# EAGLE design Jolt (EAGLE 8.3.1)
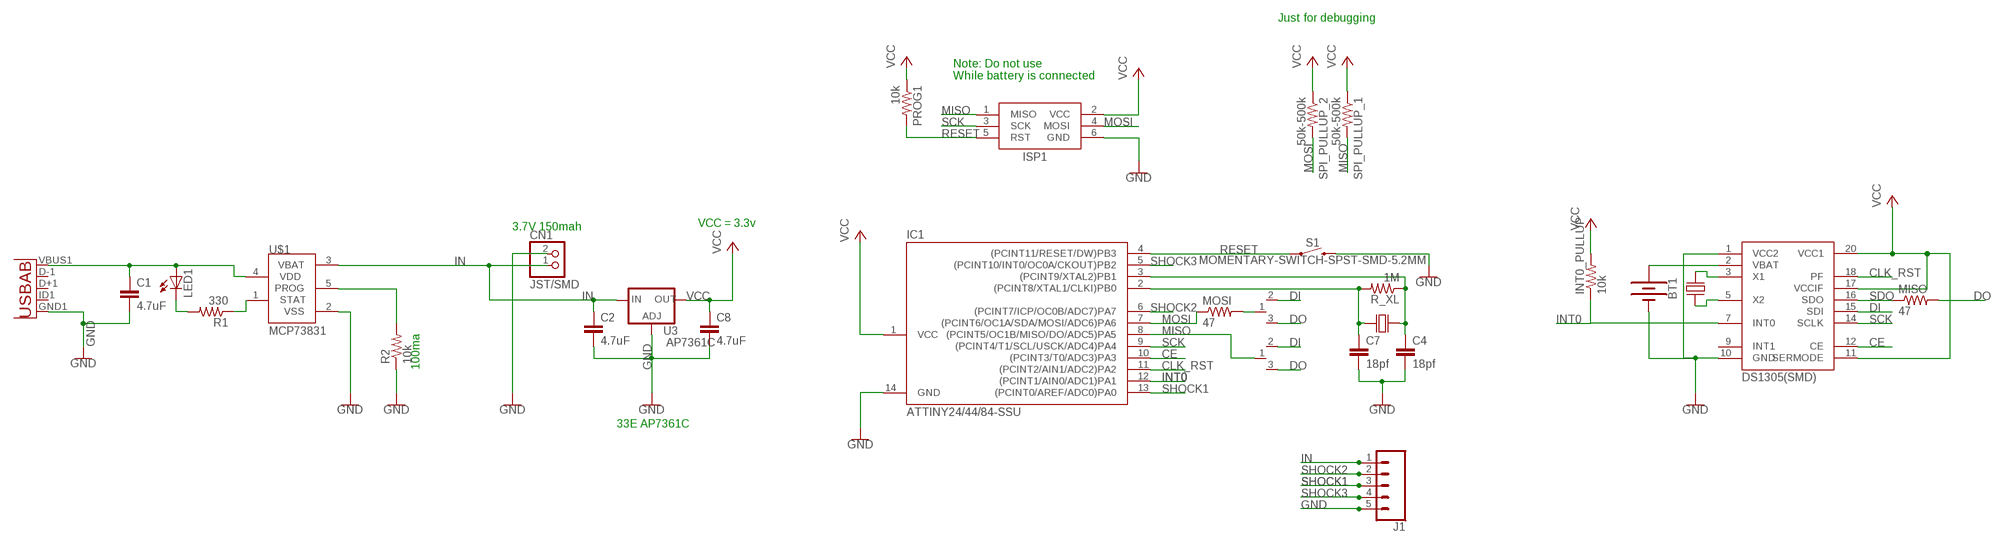
[diagram p0: schematic, sheet 1]

## Parts
BT1  BATTERY-20MM_SMD_4LEGS_OVERPASTE  [BATTCON_20MM_4LEGS_OVERPASTE]
C1  4.7uF  C-EUC0603K  [C0603K]
C2  4.7uF  C-EUC0603K  [C0603K]
C4  18pf  10NF-0603-50V-10%  [0603]
C7  18pf  10NF-0603-50V-10%  [0603]
C8  4.7uF  C-EUC0603K  [C0603K]
CN1  JST/SMD  JST_2PIN-SMT  [JST-PH-2-SMT]
IC1  ATTINY24/44/84-SSU  [SOIC14]
INT0_PULLUP  10k  R-US_R0603  [R0603]
ISP1  AVRISP-6  [AVRISP]
J1  CONN_05  [1X05]
LED1  LEDCHIPLED_0603  [CHIPLED_0603]
MISO  47  R-US_R0603  [R0603]
MOSI  47  R-US_R0603  [R0603]
PROG1  10k  R-US_R0603  [R0603]
R1  330  R-US_R0603  [R0603]
R2  10k  R-US_R0603  [R0603]
R_XL  1M  R-US_R0603  [R0603]
S1  MOMENTARY-SWITCH-SPST-SMD-5.2MM  [TACTILE_SWITCH_SMD_5.2MM]
SPI_PULLUP_1  50k-500k  R-US_R0603  [R0603]
SPI_PULLUP_2  50k-500k  R-US_R0603  [R0603]
U1  USB""  [USB-MICRO-SMD]
U3  AP7361C  V_REG_317SMD  [SOT223]
U$1  MCP73831  [SOT23-5L]
U$2  DS1305(SMD)  [TSSOP]
U$3  CRYSTAL_SOJ  [SOJ-4-5.5MM]
U$4  0603_SMD_JUMPER  [0603_SMD_JUMPER]
U$5  0603_SMD_JUMPER  [0603_SMD_JUMPER]
U$6  CRYSTAL-SMD-HC-49US  [CRYSTAL_SMD_HC-49/US]

## Nets
CE: IC1.10((PCINT3/T0/ADC3)PA3) U$2.12(CE)
CLK_RST: IC1.11((PCINT2/AIN1/ADC2)PA2) U$2.18(PF)
DI: U$2.15(SDI) U$4.2(O2) U$5.2(O2)
DO: MISO.2 U$4.3(O1) U$5.3(O1)
GND: BT1.2(-) C1.2 C2.2 C4.2 C7.2 C8.2 CN1.2 IC1.14(GND) ISP1.6(GND) J1.5 R2.1 S1.3 U1.GND1(GND) U3.1(ADJ) U$1.2(VSS) U$2.1(VCC2) U$2.10(GND)
IN: C2.1 CN1.1 J1.1 U3.3(IN) U$1.3(VBAT)
INT0: IC1.12((PCINT1/AIN0/ADC1)PA1) INT0_PULLUP.1 U$2.7(INT0)
MISO: IC1.8((PCINT5/OC1B/MISO/DO/ADC5)PA5) ISP1.1(MISO) SPI_PULLUP_1.2 U$5.1(IN)
MOSI: IC1.7((PCINT6/OC1A/SDA/MOSI/ADC6)PA6) ISP1.4(MOSI) MOSI.1 SPI_PULLUP_2.2
N$1: C1.1 LED1.A U1.VBUS1(VBUS) U$1.4(VDD)
N$2: MOSI.2 U$4.1(IN)
N$3: R1.1 U$1.1(STAT)
N$4: LED1.C R1.2
N$5: R2.2 U$1.5(PROG)
N$15: C7.1 IC1.2((PCINT8/XTAL1/CLKI)PB0) R_XL.2 U$6.P$2
N$16: C4.1 IC1.3((PCINT9/XTAL2)PB1) R_XL.1 U$6.P$1
N$20: BT1.1(+) U$2.2(VBAT)
N$22: U$2.5(X2) U$3.P$3
N$23: U$2.3(X1) U$3.P$1
RESET: IC1.4((PCINT11/RESET/DW)PB3) ISP1.5(RST) PROG1.2 S1.1
SCK: IC1.9((PCINT4/T1/SCL/USCK/ADC4)PA4) ISP1.3(SCK) U$2.14(SCLK)
SDO: MISO.1 U$2.16(SDO)
SHOCK1: IC1.13((PCINT0/AREF/ADC0)PA0) J1.3
SHOCK2: IC1.6((PCINT7/ICP/OC0B/ADC7)PA7) J1.2
SHOCK3: IC1.5((PCINT10/INT0/OC0A/CKOUT)PB2) J1.4
VCC: C8.1 IC1.1(VCC) INT0_PULLUP.2 ISP1.2(VCC) PROG1.1 SPI_PULLUP_1.1 SPI_PULLUP_2.1 U3.2(OUT) U$2.11(SERMODE) U$2.17(VCCIF) U$2.20(VCC1)
Unconnected: U1.D+1(D+) U1.D-1(D-) U1.ID1(USBID) U$2.9(INT1)

## Notes on the sheet
- Just for debugging
- Note: Do not use
  While battery is connected
- VCC = 3.3v
- 3.7V 150mah
- 100ma
- 33E AP7361C

## Library data of the parts
BT1 = SparkFun-Batteries:BATTERY: Battery - Single Cell A variety of battery chemistries, sizes, and footprints. Device List: 20MM_PTH - Coin Cell Battery Holder - 20mm (PTH) <https://www.sparkfun.com/products/783> 6.8MM_PTH - Coin Cell Battery Holder - 6.8MM(SMD) <https://www.digikey.com/product-detail/en/seiko-instruments/MS621FE-FL11E/728-1057-ND/1889208?WT.srch=1&gclid=CNOQ5a6LzdQCFZS2wAodXCkE0g> 12MM_SMD - Coin Cell Battery Holder - 12mm (SMD) <https://www.sparkfun.com/products/10592> 12MM_PTH - Coin Cell Battery Holder - 12mm (PTH) <https://www.sparkfun.com/products/7948> 20MM_SMD - 20mm Coin Cell Battery Holder (SMD) (2 legs) Used on the Big Time Watch Kit <https://www.sparkfun.com/products/11734> 20MM_SMD_4LEGS - Coin Cell Battery Holder - 20mm (SMD) <https://www.sparkfun.com/products/11892> 20MM_SMD_4LEGS_OVERPASTE - Coin Cell Battery Holder - 20mm (SMD) <https://www.sparkfun.com/products/11892> (Over-paste on the legs) 24.5MM_PTH - Coin Cell Battery Holder - 24.5mm (PTH) <https://www.sparkfun.com/products/8863> 9V - 9V Battery Holder - PC Mount Used on the SparkFun SparkPunk Sound Kit <https://www.sparkfun.com/products/11177> and SparkFun SparkPunk Sequencer Kit <https://www.sparkfun.com/products/12707> 18650 - Battery Holder - 18650 (PTH) <https://www.sparkfun.com/products/13113> AA - Battery Holder - 1xAA (PTH) <https://www.sparkfun.com/products/7949> AAA - Battery Holder - 1xAAA (PTH) <https://www.sparkfun.com/products/12718> AA_KIT - Battery Holder - 1xAA (PTH) <https://www.sparkfun.com/products/7949> Special kit package - pads only have exposed copper on one side of the board. AAA_KIT - Battery Holder - 1xAAA (PTH) <https://www.sparkfun.com/products/12718> Special kit package - pads only have exposed copper on one side of the board.; PROD_ID: PRT-11892; SF_SKU: BATT-10373
C1 C2 C8 = resistor:C-EU: CAPACITOR, European symbol
C4 C7 = SparkFun-Capacitors:10NF: 0.01uF/10nF/10,000pF ceramic capacitors A capacitor is a passive two-terminal electrical component used to store electrical energy temporarily in an electric field. CAP-09321; PROD_ID: CAP-00867; VALUE: 10nF
CN1 = adafruit:JST_2PIN: JST 2-Pin Connectors of various flavors SMT-RA (S2B-PH-SM4) 4UConnector #17311 SMT (B2B-PH-SM4) THM-RA (S2B-PH) THM (B2B-PH)
IC1 = attiny24_44_84:ATTINY24/44/84
INT0_PULLUP MISO MOSI PROG1 R1 R2 R_XL SPI_PULLUP_1 SPI_PULLUP_2 = adafruit:R-US_: RESISTOR, American symbol
ISP1 = adafruit:AVRISP: AVR ISP HEADER Standard 6 pin header for AVR programming
J1 = SparkFun-Connectors:CONN_05: Multi connection point. Often used as Generic Header-pin footprint for 0.1 inch spaced/style header connections On any of the 0.1 inch spaced packages, you can populate with these: Break Away Headers - Straight <https://www.sparkfun.com/products/116> (PRT-00116) Break Away Male Headers - Right Angle <https://www.sparkfun.com/products/553> (PRT-00553) Female Headers <https://www.sparkfun.com/products/115> (PRT-00115) Break Away Headers - Machine Pin <https://www.sparkfun.com/products/117> (PRT-00117) Break Away Female Headers - Swiss Machine Pin <https://www.sparkfun.com/products/743> (PRT-00743) For SCREWTERMINALS and SPRING TERMINALS visit here: Screw Terimnals on SparkFun.com <https://www.sparkfun.com/search/results?term=Screw+Terminals> (5mm/3.5mm/2.54mm spacing) This device is also useful as a general connection point to wire up your design to another part of your project. Our various solder wires solder well into these plated through hole pads. Hook-Up Wire - Assortment (Stranded, 22 AWG) <https://www.sparkfun.com/products/11375> (PRT-11375) Hook-Up Wire - Assortment (Solid Core, 22 AWG) <https://www.sparkfun.com/products/11367> (PRT-11367) View the entire wire category on our website here <https://www.sparkfun.com/categories/141> Special notes: Molex polarized connector foot print use with SKU : PRT-08231 with associated crimp pins and housings. 1MM SMD Version SKU: PRT-10208
LED1 = adafruit:LED: LED OSRAM: - CHIPLED LG R971, LG N971, LY N971, LG Q971, LY Q971, LO R971, LY R971 LH N974, LH R974 LS Q976, LO Q976, LY Q976 LO Q996 - Hyper CHIPLED LW Q18S LB Q993, LB Q99A, LB R99A - SideLED LS A670, LO A670, LY A670, LG A670, LP A670 LB A673, LV A673, LT A673, LW A673 LH A674 LY A675 LS A676, LA A676, LO A676, LY A676, LW A676 LS A679, LY A679, LG A679 - Hyper Micro SIDELED® LS Y876, LA Y876, LO Y876, LY Y876 LT Y87S - SmartLED LW L88C, LW L88S LB L89C, LB L89S, LG L890 LS L89K, LO L89K, LY L89K LS L896, LA L896, LO L896, LY L896 - TOPLED LS T670, LO T670, LY T670, LG T670, LP T670 LSG T670, LSP T670, LSY T670, LOP T670, LYG T670 LG T671, LOG T671, LSG T671 LB T673, LV T673, LT T673, LW T673 LH T674 LS T676, LA T676, LO T676, LY T676, LB T676, LH T676, LSB T676, LW T676 LB T67C, LV T67C, LT T67C, LS T67K, LO T67K, LY T67K, LW E67C LS E67B, LA E67B, LO E67B, LY E67B, LB E67C, LV E67C, LT E67C LW T67C LS T679, LY T679, LG T679 LS T770, LO T770, LY T770, LG T770, LP T770 LB T773, LV T773, LT T773, LW T773 LH T774 LS E675, LA E675, LY E675, LS T675 LS T776, LA T776, LO T776, LY T776, LB T776 LHGB T686 LT T68C, LB T68C - Hyper Mini TOPLED® LB M676 - Mini TOPLED Santana® LG M470 LS M47K, LO M47K, LY M47K Source: http://www.osram.convergy.de/
S1 = SparkFun-Switches:MOMENTARY-SWITCH-SPST: Momentary Switch (Pushbutton) - SPST Normally-open (NO) SPST momentary switches (buttons, pushbuttons). Variants PTH-12MM - 12mm square, through-hole Momentary Pushbutton Switch - 12mm Square <https://www.sparkfun.com/products/9190> (COM-09190) PTH-6.0MM, PTH-6.0MM-KIT - 6.0mm square, through-hole Mini Pushbutton Switch <https://www.sparkfun.com/products/97> (COM-00097) KIT package intended for soldering kit's - only one side of pads' copper is exposed. PTH-RIGHT-ANGLE-KIT - Right-angle, through-hole Right Angle Tactile Button <https://www.sparkfun.com/products/10791> - Used on SparkFun BigTime Watch Kit <https://www.sparkfun.com/products/11734> SMD-12MM - 12mm square, surface-mount Tactile Button - SMD (12mm) <https://www.sparkfun.com/products/12993> (COM-12993) Used on SparkFun PicoBoard <https://www.sparkfun.com/products/11888> SMD-4.5MM - 4.5mm Square Trackball Switch Used on SparkFun Blackberry Trackballer Breakout <https://www.sparkfun.com/products/13169> SMD-4.6MMX2.8MM - 4.60mm x 2.80mm, surface mount Used on SparkFun SAMD21 Mini Breakout <https://www.sparkfun.com/products/13664> SMD-5.2MM, SMD-5.2-REDUNDANT - 5.2mm square, surface-mount Mini Pushbutton Switch - SMD <https://www.sparkfun.com/products/8720> (COM-08720) Used on Arduino Pro Mini <https://www.sparkfun.com/products/11114> REDUNDANT package connects both switch circuits together SMD-6.0X3.5MM - 6.0 x 3.5mm, surface mount Momentary Reset Switch SMD <https://www.sparkfun.com/products/8229> (COM-08229) SMD-6.2MM-TALL - 6.2mm square, surface mount Tactile Button - SMD (6mm) <https://www.sparkfun.com/products/12992> Used on SparkFun Digital Sandbox <https://www.sparkfun.com/products/12651> SMD-RIGHT-ANGLE - Right-angle, surface mount Used on SparkFun Block for Intel® Edison - Arduino <https://www.sparkfun.com/products/13036>; PROD_ID: SWCH-08247; SF_SKU: COM-08720
U1 = MicroUSB:USB: This is a USB AB connector that is compatible with USB OTG. i.e. this connector can serve as a host or device
U3 = SparkFun-IC-Power:V_REG_317: Voltage Regulator Standard LM317 adjustable voltage regulator. AOI (Adjust Output Input). Google 'LM317 Calculator' for easy to use app to get the two resistor values needed. 240/720 for 5V output. 240/390 for 3.3V output. Spark Fun Electronics SKU : COM-00527
U$1 = mcp73831:MCP73831: Miniature Single-Cell, Fully Integrated Li-Ion, Li-Polymer Charge Management Controllers
U$2 = Nick's Personal Part:DS1305(SMD)
U$3 = Nick's Personal Part:CRYSTAL_SOJ
U$4 U$5 = Nick's Personal Part:0603_SMD_JUMPER
U$6 = Nick's Personal Part:CRYSTAL-SMD-HC-49US

## Module REGULATOR
Ports: 

### Library data of the parts

## Board
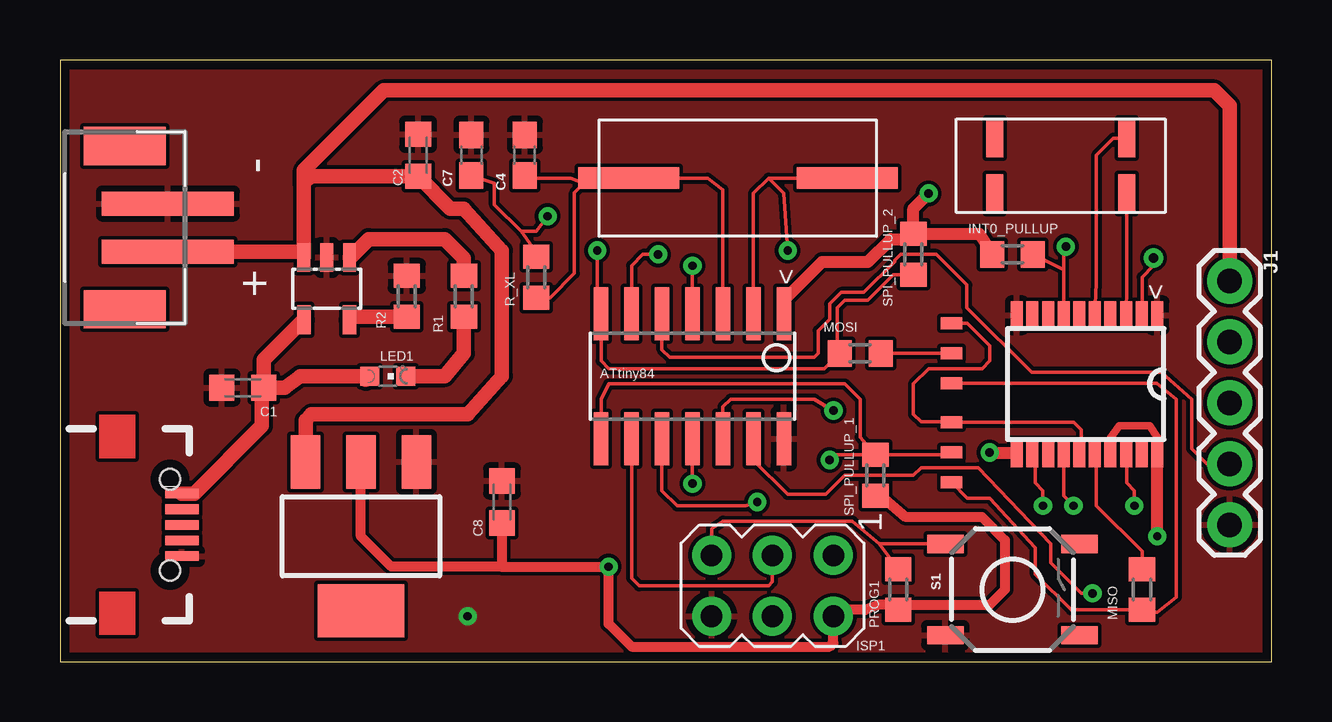
[diagram p1: board, top side]
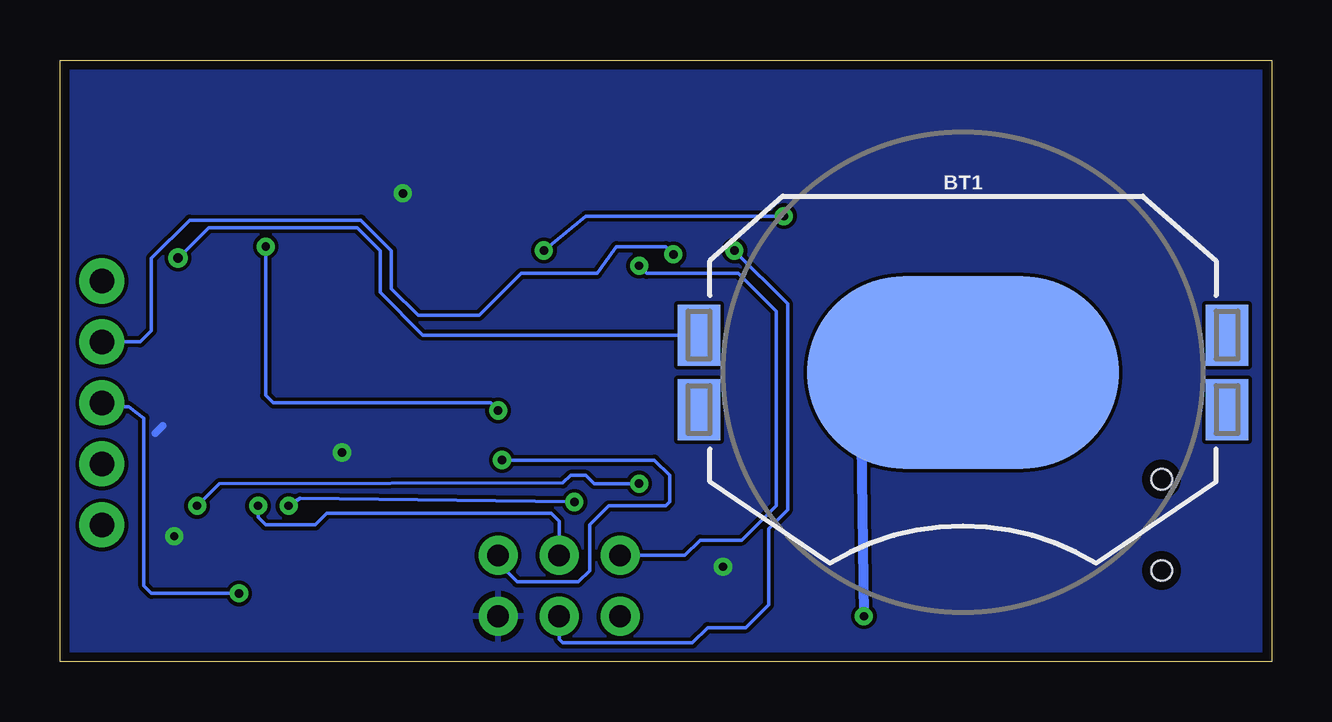
[diagram p2: board, bottom side, seen from below]

Size 50.48 x 25.08 mm. Coordinates in mm from the lower left corner, seen from the top.
Outline: 50.48,25.08 0,25.08 0,0 50.48,0 50.48,25.08
Copper layers (1*16): Top 0.035mm / dielectric 1.5mm / Bottom 0.035mm
Design rules "default *": minimum track width 6mil, minimum drill 0.35mm, track to track 6mil, track to pad 6mil, pad to pad 6mil, via to via 6mil, smd to smd 6mil, copper to edge 15mil, drill to drill 6mil, minimum pad ring 10mil, minimum via ring 8mil, stop-mask expansion 4mil, vias tented up to drill 0mil, thermal gap 10mil

### Footprints (pad centres in the part's own frame; a part is rotated, then mirrored left to right if it is on the bottom)
BATTCON_20MM_4LEGS_OVERPASTE = smd 1.778 x 2.54: 1 -11,1.55; 3 11,1.55; P$1 -11,-1.55; P$2 11,-1.55 | smd 13 x 8: 2 0,0
C0603K = smd 1.05 x 1.08: 1 -0.875,0; 2 0.875,0
0603 = smd 1.1 x 1: 1 -0.85,0; 2 0.85,0
JST-PH-2-SMT = smd 1 x 5.5: 1 -1,-1.8; 2 1,-1.8 | smd 1.6 x 3.4: NC1 -3.4,0; NC2 3.4,0
SOIC14 = smd 0.61 x 2.21: 1 -3.81,-2.603; 2 -2.54,-2.603; 3 -1.27,-2.603; 4 0,-2.603; 5 1.27,-2.603; 6 2.54,-2.603; 7 3.81,-2.603; 8 3.81,2.603; 9 2.54,2.603; 10 1.27,2.603; 11 0,2.603; 12 -1.27,2.603; 13 -2.54,2.603; 14 -3.81,2.603
R0603 = smd 1 x 1.1: 1 -0.85,0; 2 0.85,0
AVRISP = drill 0.9 pad 1.626: 1 -1.27,2.54; 2 1.27,2.54; 3 -1.27,0; 4 1.27,0; 5 -1.27,-2.54; 6 1.27,-2.54
1X05 = drill 1.016 pad 1.88: 1 0,0; 2 2.54,0; 3 5.08,0; 4 7.62,0; 5 10.16,0
CHIPLED_0603 = smd 0.8 x 0.8: A 0,-0.75; C 0,0.75
TACTILE_SWITCH_SMD_5.2MM = smd 1.524 x 0.762: 1 -2.794,1.905; 2 2.794,1.905; 3 -2.794,-1.905; 4 2.794,-1.905
USB-MICRO-SMD = smd 1.4 x 0.4: D+1 2.7,0; D-1 2.7,0.65; GND1 2.7,-1.3; ID1 2.7,-0.65; VBUS1 2.7,1.3 | hole 0.85: 2.2,1.9; 2.2,-1.9
SOT223 = smd 1.219 x 2.235: 1 -2.311,-3.099; 2 0,-3.099; 3 2.311,-3.099 | smd 3.6 x 2.2: 4 0,3.099
SOT23-5L = smd 0.533 x 1.2: 1 -0.95,-1.3; 2 0,-1.3; 3 0.95,-1.3 | smd 0.55 x 1.2: 4 0.95,1.3; 5 -0.95,1.3
TSSOP = smd 1.15 x 0.5: 1 0,0; 2 0,-0.65; 3 0,-1.3; 4 0,-1.95; 5 0,-2.6; 6 0,-3.25; 7 0,-3.9; 8 0,-4.55; 9 0,-5.2; 10 0,-5.85; 11 5.75,-5.85; 12 5.75,-5.2; 13 5.75,-4.55; 14 5.75,-3.9; 15 5.75,-3.25; 16 5.75,-2.6; 17 5.75,-1.95; 18 5.75,-1.3; 19 5.75,-0.65; 20 5.75,0
SOJ-4-5.5MM = smd 0.7 x 1.6: P$1 0,0; P$2 5.5,0; P$3 0,-2.3; P$4 5.5,-2.3
0603_SMD_JUMPER = smd 0.9 x 0.5: 1 0,0; 2 0,1.25; 3 0,-1.25
CRYSTAL_SMD_HC-49/US = smd 4.22 x 0.9: P$1 2.11,0; P$2 11.21,0

### Placement (x,y rotation side)
BT1  12.86,12.06 0 bottom
C1  7.62,11.43 180 top
C2  14.92,21.11 90 top
C4  19.37,21.11 90 top
C7  17.14,21.11 90 top
C8  18.41,6.67 90 top
CN1  2.7,18.1 90 top
IC1  26.35,11.91 180 top
INT0_PULLUP  39.69,16.99 180 top
ISP1  29.69,3.17 270 top
J1  48.74,15.88 270 top
LED1  13.65,11.91 270 top
MISO  45.08,3.02 270 top
MOSI  33.34,12.86 0 top
PROG1  34.92,3.02 90 top
R1  16.83,15.24 270 top
R2  14.45,15.24 270 top
R_XL  19.84,16.03 90 top
S1  39.69,3.02 0 top
SPI_PULLUP_1  33.97,7.78 90 top
SPI_PULLUP_2  35.56,16.99 270 top
U1  2.38,5.71 0 top
U3  12.54,5.24 180 top
U$1  11.11,15.56 180 top
U$2  45.72,14.45 270 top
U$3  44.45,19.53 180 top
U$4  37.15,12.86 0 top
U$5  37.15,8.73 0 top
U$6  21.59,20.16 0 top

### Tracks (layer width: path | path; a pad name or v marks a point on that pad's centre or on a via)
CE  (via drill 0.35)
  Top 0.152: IC1.10 25.08,7.14 25.72,6.51 28.57,6.51 v29.05,6.67 | U$2.12 40.64,8.58 40.64,7.46 40.96,7.14 v40.96,6.51
  Bottom 0.152: v29.05,6.67 40.48,6.83 v40.96,6.51
CLK_RST  (via drill 0.35)
  Top 0.15: v44.77,6.51 44.77,7.14 44.45,7.46 44.45,8.67
  Top 0.152: IC1.11 v26.35,7.43 | 44.45,8.67 U$2.18
  Bottom 0.152: v26.35,7.43 28.23,7.43 28.57,7.78 29.21,7.78 29.53,7.46 43.84,7.43 v44.77,6.51
DI
  Top 0.152: U$2.15 42.54,8.77 42.54,9.68 42.25,9.98 U$5.2 37.13,10 35.88,10 35.56,10.32 35.56,11.59 36.19,12.22 38.42,12.22 38.74,12.54 38.74,13.18 37.8,14.11 U$4.2
DO
  Top 0.152: 44.98,2.17 MISO.2 | 44.98,2.17 42.13,2.17 40.64,3.65 40.64,4.76 38.74,6.83 37.8,6.83 U$5.3 | U$4.3 45.7,11.61 46.51,10.95 46.51,2.7 45.72,2.06 45.08,2.06 44.98,2.17
GND  (via drill 0.35)
  Bottom 0.406: BT1.2 17.14,12.07 v16.99,1.91
  pour Top: -1.75,-1.75 -0.63,29.05 53.5,28.26 54.77,-4.92
IN
  Top 0.406: U$1.3 | 10.57,20.24 10.16,19.83
  Top 0.61: CN1.1 10.16,17.1 U$1.3 | J1.1 48.74,23.18 48.1,23.81 13.49,23.81 10.16,20.48 10.16,19.83 U$1.3 | 10.57,20.24 C2.1 16.27,18.89 16.83,18.89 18.42,17.15 18.42,11.91 16.99,10.32 10.48,10.32 10.23,10.07 U3.3
INT0  (via drill 0.35)
  Top 0.152: U$2.7 41.82,16.34 | 41.82,16.34 INT0_PULLUP.1 | 41.82,16.34 41.82,17.21 v41.91,17.3 | v32.23,10.48 31.43,10.95 27.94,10.95 27.62,10.64 IC1.12
  Bottom 0.152: v41.91,17.3 41.91,11.11 41.59,10.8 32.54,10.8 v32.23,10.48
MISO  (via drill 0.35)
  Top 0.152: IC1.8 22.54,10.95 22.86,11.59 32.7,11.59 33.34,10.95 33.34,9.37 SPI_PULLUP_1.2 | SPI_PULLUP_1.2 37.05,8.63 U$5.1 | SPI_PULLUP_1.2 32.28,8.63 v32.07,8.41
  Bottom 0.152: v32.07,8.41 25.72,8.41 25.08,7.78 25.08,6.67 25.24,6.51 27.62,6.51 28.42,5.72 28.42,3.81 28.89,3.33 31.43,3.33 32.23,4.13 ISP1.1
MOSI  (via drill 0.35)
  Top 0.152: 22.54,13.64 IC1.7 22.54,12.54 22.86,12.22 31.85,12.22 MOSI.1 32.39,13.07 32.39,14.76 32.7,15.08 33.66,15.08 34.71,16.14 SPI_PULLUP_2.2 | 22.54,13.64 22.54,13.49 | v22.38,17.15 22.37,13.81 22.54,13.64
  Bottom 0.152: ISP1.4 29.69,0.95 29.53,0.79 24.13,0.79 23.5,1.43 21.91,1.43 20.95,2.38 20.95,5.56 20.16,6.35 20.16,14.92 v22.38,17.15
N$1
  Top 0.61: U1.VBUS1 5.59,7.02 8.41,9.84 8.41,11.35 C1.1 | C1.1 8.49,12.59 U$1.4 | 12.74,11.76 LED1.A 10,11.91 9.37,11.43 C1.1
N$2
  Top 0.152: MOSI.2 U$4.1
N$3
  Top 0.61: 12.06,16.88 U$1.1 12.06,16.83 12.86,17.62 16.03,17.62 16.83,16.83 R1.1
N$4
  Top 0.61: LED1.C 16.03,11.91 16.83,12.86 R1.2
N$5
  Top 0.61: R2.2 12.19,14.39 U$1.5
N$15  (via drill 0.35)
  Top 0.152: 29.53,20.16 U$6.P$2 | 29.53,20.16 28.89,19.53 IC1.2 | R_XL.2 19.69,17.3 19.21,17.94 | 19.21,17.94 18.1,19.05 18.1,19.95 C7.1 17.57,19.95 | 19.21,17.94 19.84,17.94 v20.32,18.57 | v30.32,17.15 30.16,19.53 29.53,20.16
  Bottom 0.152: v20.32,18.57 28.57,18.57 v30.32,17.15
N$16
  Top 0.152: IC1.3 27.62,19.69 26.99,20.16 U$6.P$1 22.22,20.16 22.01,19.95 21.83,19.95 | 21.83,19.95 21.27,20.16 19.37,20.16 C4.1 | R_XL.1 20.42,15.18 21.43,16.19 21.43,19.55 21.83,19.95
N$20  (via drill 0.4)
  Top 0.152: v45.56,16.83 45.56,16.51 45.08,16.03 45.08,14.46 U$2.2
  Bottom 0.152: v45.56,16.83 44.29,18.1 38.1,18.1 37.15,17.15 37.15,15.4 35.36,13.62 BT1.1
N$22
  Top 0.152: U$3.P$3 43.89,21.83 43.18,21.11 43.18,15.78 U$2.5
N$23
  Top 0.152: U$3.P$1 44.45,15.75 U$2.3
RESET  (via drill 0.35)
  Top 0.152: 34.13,4.92 PROG1.2 | 34.13,4.92 S1.1 | ISP1.5 27.15,5.56 27.62,5.87 33.02,5.87 34.13,4.92 | IC1.4 v26.35,16.51
  Bottom 0.152: ISP1.5 25.24,4.45 | 25.24,4.45 25.08,4.45 | 25.24,4.45 24.45,4.45 23.81,5.08 22.07,5.08 20.64,6.51 20.64,14.61 22.22,16.19 26.03,16.19 v26.35,16.51
SCK  (via drill 0.35)
  Top 0.152: ISP1.3 29.69,3.33 29.53,3.18 24.13,3.18 23.81,3.49 IC1.9 | U$2.14 41.82,6.92 v42.23,6.51
  Bottom 0.152: v42.23,6.51 42.23,6.03 41.91,5.72 39.85,5.72 39.37,6.19 30,6.19 29.69,5.87 ISP1.3
SDO
  Top 0.152: MISO.1 45.08,4.6 43.18,6.51 43.18,8.64 U$2.16
SHOCK1  (via drill 0.35)
  Top 0.152: IC1.13 28.89,8.41 30.32,6.99 31.91,6.99 32.7,7.78 35.56,7.78 35.88,8.1 38.26,8.1 41.28,4.92 41.28,4.13 42.54,2.86 v43.02,2.86
  Bottom 0.15: J1.3 48.58,10.64 47.63,10.64 46.99,10.16 46.99,3.18 46.67,2.86 v43.02,2.86
SHOCK2  (via drill 0.35)
  Top 0.152: v24.92,16.99 24.29,16.99 23.81,16.51 IC1.6
  Bottom 0.15: 46.67,15.08 46.67,13.81 47.15,13.34 J1.2
  Bottom 0.152: 46.67,15.08 46.67,16.83 45.08,18.42 37.94,18.42 36.67,17.15 36.67,15.56 35.56,14.45 33.02,14.45 31.27,16.19 28.1,16.19 27.3,17.3 25.24,17.3 v24.92,16.99
SHOCK3
  Top 0.152: J1.4 47.78,8.26 47.15,8.89 47.15,10.95 45.88,12.07 40.48,12.07 37.78,14.76 37.78,15.72 36.51,16.99 35.04,16.99 34.78,16.73 34.78,16.68 33.5,15.4 32.54,15.4 32.07,14.92 32.07,14.29 31.59,13.81 31.59,12.86 31.43,12.7 25.4,12.7 25.08,13.02 IC1.5
VCC  (via drill 0.35)
  Top 0.152: SPI_PULLUP_1.1 34.19,6.93 | IC1.1 30.16,15.08 | 35.34,17.62 SPI_PULLUP_2.1 | 38.77,8.7 v38.74,8.73 | PROG1.1 34.93,2.38
  Top 0.305: U$2.17 43.77,9.32 44.13,9.84 45.4,9.84 45.72,9.37 U$2.20
  Top 0.406: 34.19,6.93 35.24,6.03 38.42,6.03 39.37,5.08 39.37,3.02 38.74,2.38 34.93,2.38 34.09,2.38 33.56,2.17 32.49,2.17 ISP1.2 32.23,0.79 32.07,0.64 23.81,0.64 22.86,1.59 v22.86,3.97 18.36,3.97 | U3.2 12.54,5.24 13.81,3.97 18.36,3.97 | C8.1 18.42,4.02 18.36,3.97
  Top 0.508: 30.16,15.08 31.75,16.67 33.66,16.67 34.61,17.62 35.34,17.62 | INT0_PULLUP.2 38.3,17.84 SPI_PULLUP_2.1 35.56,18.89 v36.19,19.53 | U$2.11 38.77,8.7 | v45.72,5.24 U$2.20
  Bottom 0.305: 46.2,9.84 46.51,9.53
  pour Bottom: -3.97,-2.54 -2.7,28.57 53.66,26.35 54.45,-6.19

### Text on the board
tNames: < | < | ATtiny84
bNames: Hulsey / 11-6-2018 / Rev-1
tStop: Jolt 2018 / Generate